# Altium project OTimCon_Station.PrjPcb
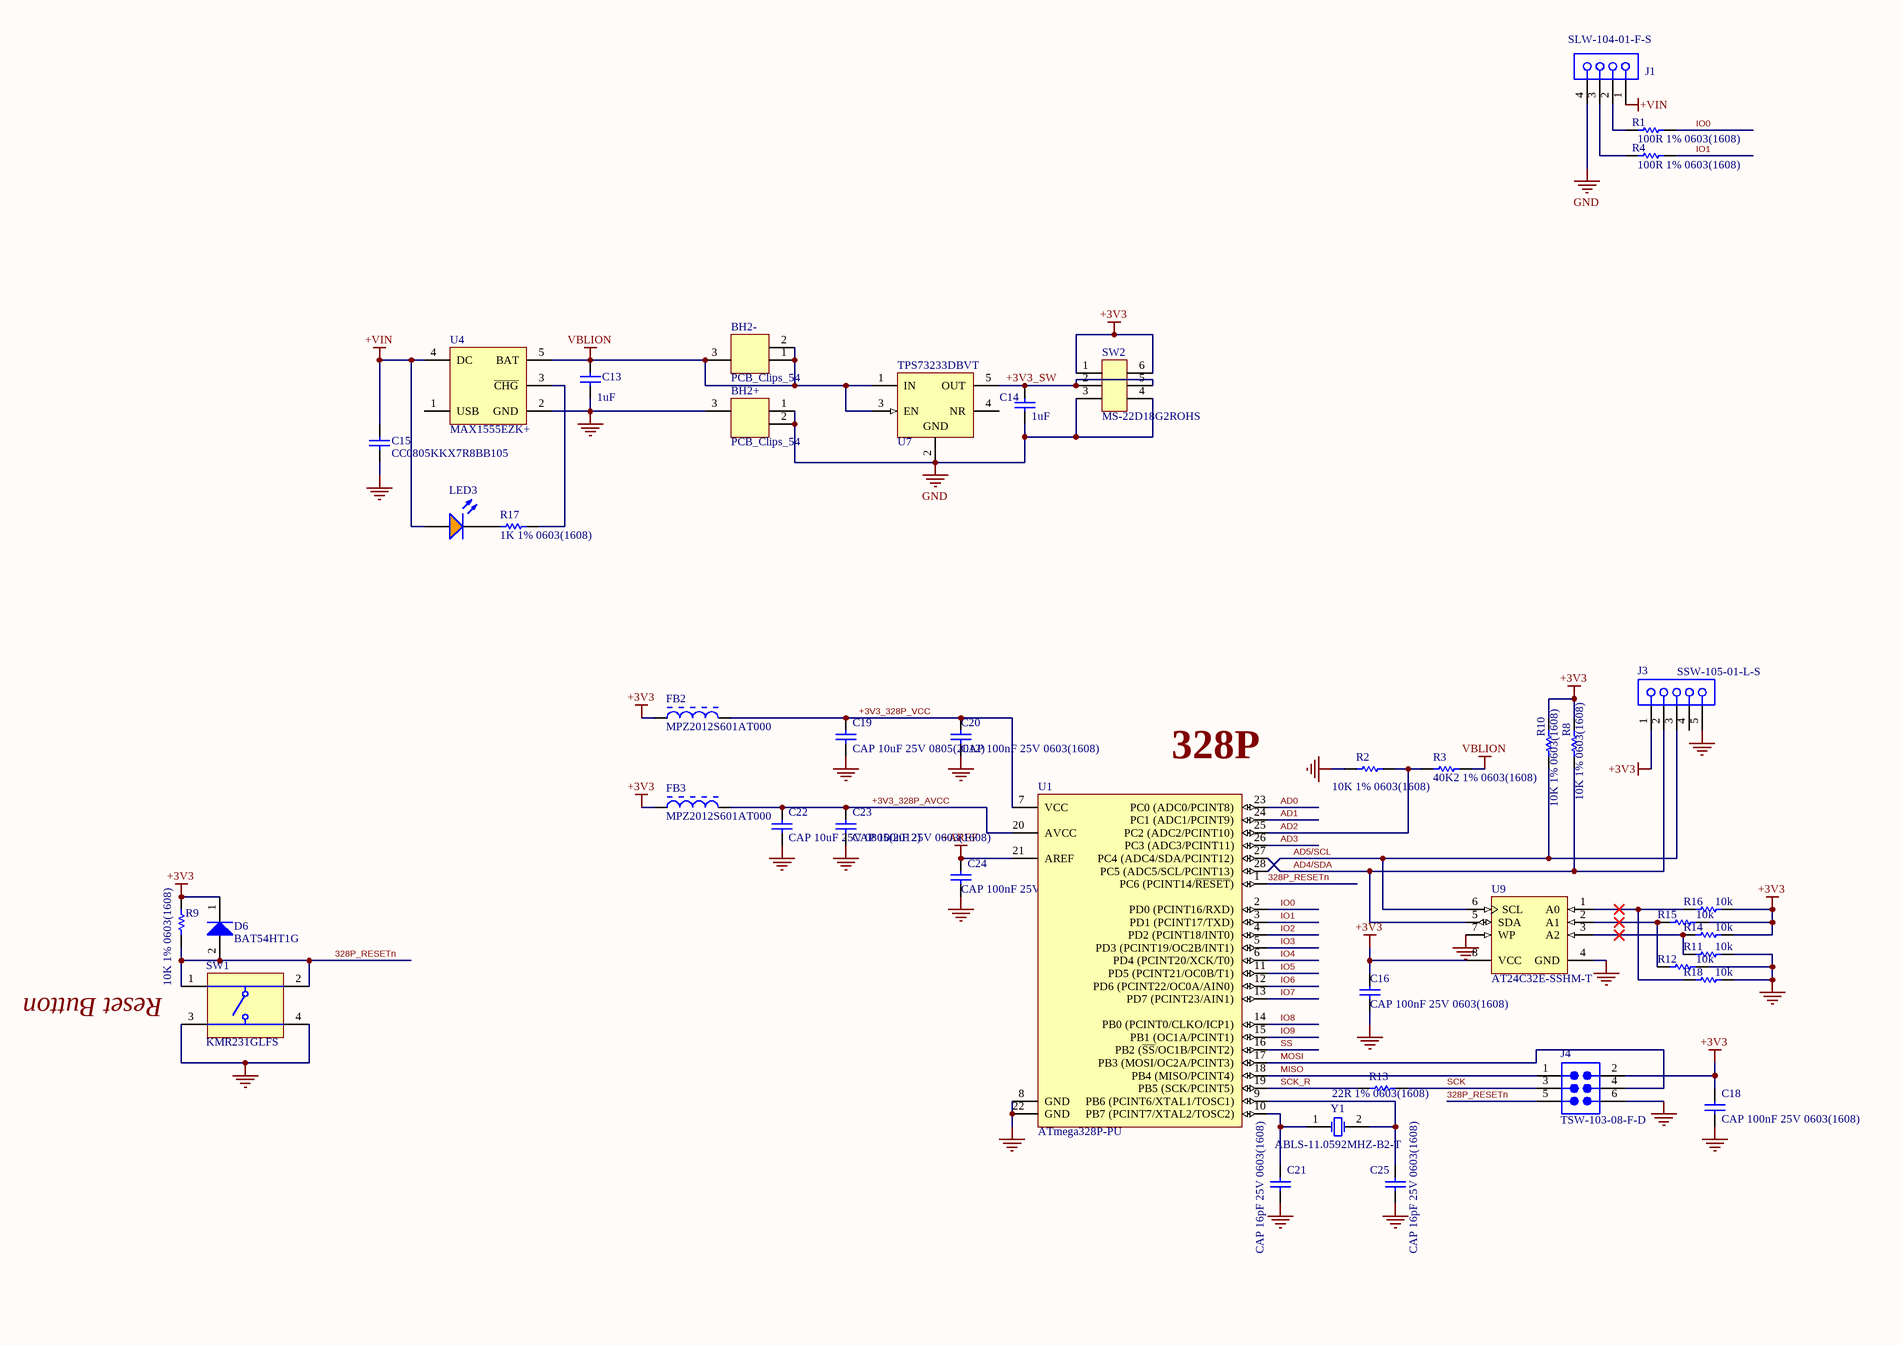
[diagram p0: OTimCon_Station.SchDoc, left]
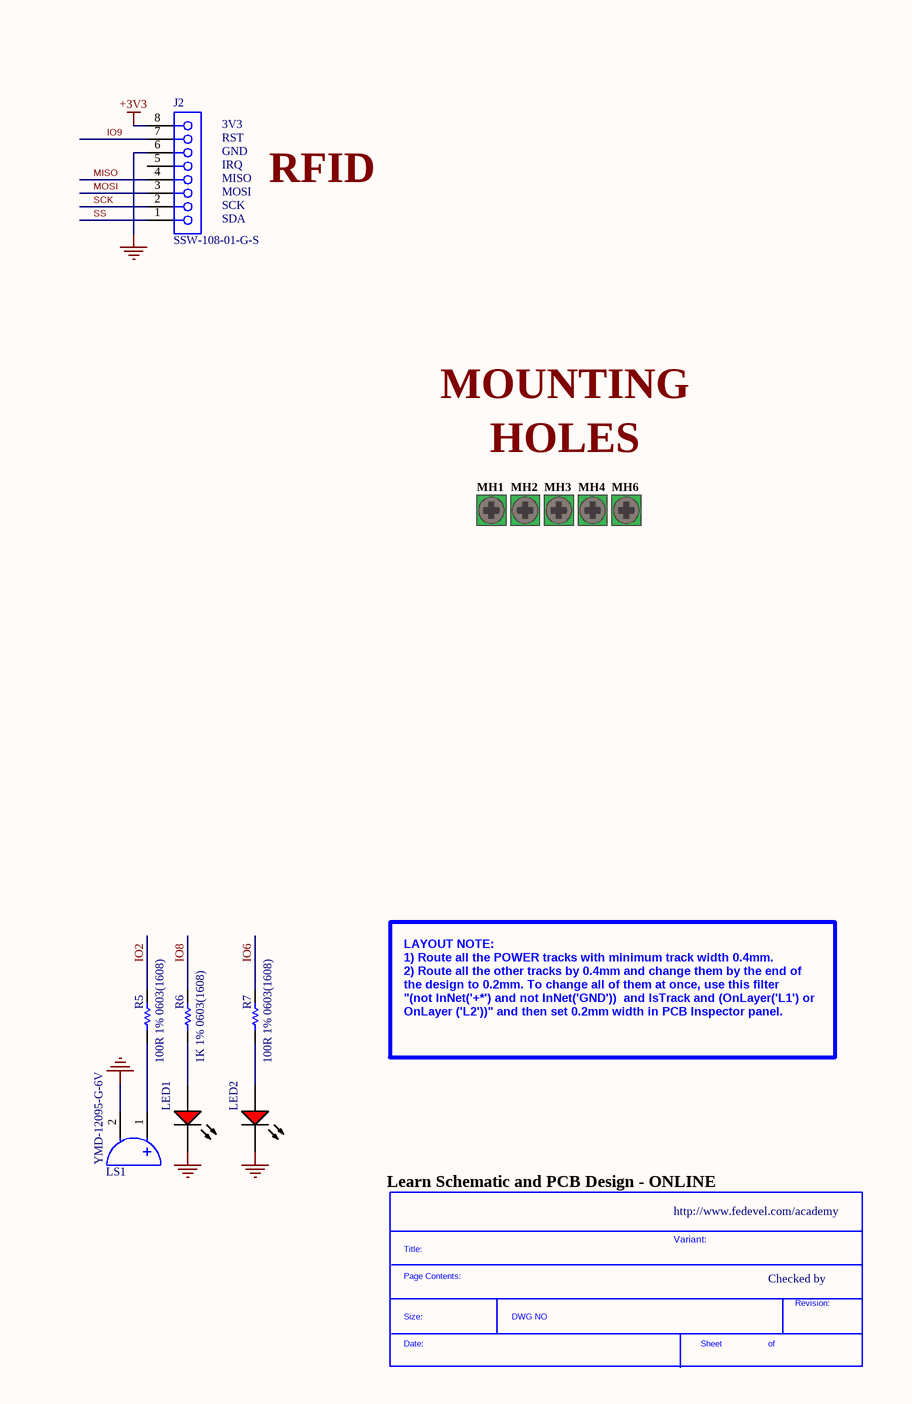
[diagram p1: OTimCon_Station.SchDoc, right]
ClientContactEmail: kus.michal@gmail.com; ClientContactName: Micha³ Kuœ; NotFitted: NF; Project: OTimCon-Board; VersionRevision: ver. 0.2
1 sheet, 56 parts. Net scope: global (net labels, ports and power ports of the same name join across sheets).
Board file: OTimCon_Station.PcbDoc

## Sheet OTimCon_Station.SchDoc
size A2; DocumentNumber: 3; SheetNumber: 3; SheetTotal: 5; PageSetup: Record=PageOptions|CenterHorizontal=True|CenterVertical=True|PrintScale=0.73|XCorrection=1.00|YCorrection=1.00|PrintKind=0|BorderSize=5000000|LeftOffset=0|BottomOffset=0|Orientation=2|PaperLength=1000|PaperWidth=1000|Scale=100|PaperSource=7|PrintQuality=-3|MediaType=1|DitherType=10|PrintScaleMode=1|PaperKind=A3|PaperIndex=8

### Parts
*  SDTitleBlock  (value not drawn)  (graphical)
BH2+  PCB_Clips_54  [KEYSTONE-CLIPS_54-3_V]
BH2-  PCB_Clips_54  [KEYSTONE-CLIPS_54-3_V]
C13  Capacitance: 1uF  [CAPC2013X145X50ML20T25]  (hidden comment: CC0805KKX7R8BB105)
C14  Capacitance: 1uF  [CAPC2013X145X50ML20T25]  (hidden comment: CC0805KKX7R8BB105)
C15  CC0805KKX7R8BB105  [CAPC2013X145X50ML20T25]
C16  CAP 100nF 25V 0603(1608)  [CAPC0603(1608)100_M]
C18  CAP 100nF 25V 0603(1608)  [CAPC0603(1608)100_M]
C19  CAP 10uF 25V 0805(2012)  [CAPC0805(2012)145_N]
C20  CAP 100nF 25V 0603(1608)  [CAPC0603(1608)100_M]
C21  CAP 16pF 25V 0603(1608)  [CAPC0603(1608)100_L]
C22  CAP 10uF 25V 0805(2012)  [CAPC0805(2012)145_N]
C23  CAP 100nF 25V 0603(1608)  [CAPC0603(1608)100_M]
C24  CAP 100nF 25V 0603(1608)  [CAPC0603(1608)100_M]
C25  CAP 16pF 25V 0603(1608)  [CAPC0603(1608)100_L]
D6  BAT54HT1G  [ONSC-SOD-323-2-477-02_V]
FB2  MPZ2012S601AT000  [TDK-MPZ2012_V]
FB3  MPZ2012S601AT000  [TDK-MPZ2012_V]
J1  SLW-104-01-F-S  [SMTC-SLW-104-01-X-S]
J2  SSW-108-01-G-S  [SMTC-SSW-108-01-G-S]
J3  SSW-105-01-L-S  [SMTC-SSW-105-01-X-S]
J4  TSW-103-08-F-D  [SMTC-TSW-103-08-X-D]
LED1  C503B-RAN-CY0B0AA2  [CREE-C503B-RAN]  (value not drawn)
LED2  C503B-RAN-CY0B0AA2  [CREE-C503B-RAN]  (value not drawn)
LED3  LTST-C190KFKT  [LTST-C190KFKT_V]  (value not drawn)
LS1  YMD-12095-G-6V  [HKDZ-YMD-12095-G-2_V]
MH1  Mounting Hole (Screw)  [Mounting-Hole-Altium]  (value not drawn)  (no BOM)
MH2  Mounting Hole (Screw)  [Mounting-Hole-Altium]  (value not drawn)  (no BOM)
MH3  Mounting Hole (Screw)  [Mounting-Hole-Altium]  (value not drawn)  (no BOM)
MH4  Mounting Hole (Screw)  [Mounting-Hole-Altium]  (value not drawn)  (no BOM)
MH6  Mounting Hole (Screw)  [Mounting-Hole-Altium]  (value not drawn)  (no BOM)
R1  100R 1% 0603(1608)  [RESC0603(1608)_M]
R2  10K 1% 0603(1608)  [RESC0603(1608)_N]
R3  40K2 1% 0603(1608)  [RESC0603(1608)_M]
R4  100R 1% 0603(1608)  [RESC0603(1608)_M]
R5  100R 1% 0603(1608)  [RESC0603(1608)_M]
R6  1K 1% 0603(1608)  [RESC0603(1608)_M]
R7  100R 1% 0603(1608)  [RESC0603(1608)_M]
R8  10K 1% 0603(1608)  [RESC0603(1608)_N]
R9  10K 1% 0603(1608)  [RESC0603(1608)_N]
R10  10K 1% 0603(1608)  [RESC0603(1608)_N]
R11  value 10k  [RESC0603(1608)_N]  (hidden comment: 10K 1% 0603(1608))
R12  value 10k  [RESC0603(1608)_N]  (hidden comment: 10K 1% 0603(1608))
R13  22R 1% 0603(1608)  [RESC0603(1608)_M]
R14  value 10k  [RESC0603(1608)_N]  (hidden comment: 10K 1% 0603(1608))
R15  value 10k  [RESC0603(1608)_N]  (hidden comment: 10K 1% 0603(1608))
R16  value 10k  [RESC0603(1608)_N]  (hidden comment: 10K 1% 0603(1608))
R17  1K 1% 0603(1608)  [RESC0603(1608)_M]
R18  value 10k  [RESC0603(1608)_N]  (hidden comment: 10K 1% 0603(1608))
SW1  KMR231GLFS  [CKCP-KMR231GLFS]
SW2  MS-22D18G2ROHS  [DYL-MS22D18G2ROHS-6_V]
U1  ATmega328P-PU  [28P3]
U4  MAX1555EZK+  [MAXM-Z5+1_M]
U7  TPS73233DBVT  [DBV0005A_N]
U9  AT24C32E-SSHM-T  [ATML-8S1_A_L]
Y1  ABLS-11.0592MHZ-B2-T  [ABRA-ABLS-11.0592MHZ-B2-T_V]

### Nets
+3V3: C16.2 C18.2 D6.1(K) FB2.1 FB3.1 J2.8 J3.1 J4.2 R8.1 R9.1 R10.1 R14.2 R15.1 R16.2 SW2.1 SW2.6 U9.8(VCC)
+AREF: C24.2 U1.21(AREF)
+VIN: C15.1 J1.1 LED3.1(A) U4.4(DC)
GND: BH2+.1 BH2+.2 BH2+.3 C13.2 C14.2 C15.2 C16.1 C18.1 C19.1 C20.1 C21.1 C22.1 C23.1 C24.1 C25.1 J1.4 J2.6 J3.5 J4.6 LED1.2(K) LED2.2(K) LS1.2(K) R2.1 R11.2 R12.1 R18.2 SW1.3 SW1.4 SW2.3 SW2.4 U1.8(GND) U1.22(GND) U4.2(GND) U7.2(GND) U9.4(GND) U9.7(WP)
VBLION: BH2-.1 BH2-.2 BH2-.3 C13.1 R3.2 U4.5(BAT) U7.1(IN) U7.3(EN)
328P_RESETn: D6.2(A) J4.5 R9.2 SW1.1 SW1.2 U1.1(PC6_(PCINT14/~{RESET}))
+3V3_328P_AVCC: C22.2 C23.2 FB3.2 U1.20(AVCC)
+3V3_328P_VCC: C19.2 C20.2 FB2.2 U1.7(VCC)
+3V3_SW: C14.1 SW2.2 SW2.5 U7.5(OUT)
AD0: U1.23(PC0_(ADC0/PCINT8))
AD1: U1.24(PC1_(ADC1/PCINT9))
AD2: R2.2 R3.1 U1.25(PC2_(ADC2/PCINT10))
AD3: U1.26(PC3_(ADC3/PCINT11))
AD4/SDA: J3.2 R8.2 U1.27(PC4_(ADC4/SDA/PCINT12)) U9.5(SDA)
AD5/SCL: J3.3 R10.2 U1.28(PC5_(ADC5/SCL/PCINT13)) U9.6(SCL)
IO0: R1.2 U1.2(PD0_(PCINT16/RXD))
IO1: R4.2 U1.3(PD1_(PCINT17/TXD))
IO2: R5.2 U1.4(PD2_(PCINT18/INT0))
IO3: U1.5(PD3_(PCINT19/OC2B/INT1))
IO4: U1.6(PD4_(PCINT20/XCK/T0))
IO5: U1.11(PD5_(PCINT21/OC0B/T1))
IO6: R7.2 U1.12(PD6_(PCINT22/OC0A/AIN0))
IO7: U1.13(PD7_(PCINT23/AIN1))
IO8: R6.1 U1.14(PB0_(PCINT0/CLKO/ICP1))
IO9: J2.7 U1.15(PB1_(OC1A/PCINT1))
MISO: J2.4 J4.1 U1.18(PB4_(MISO/PCINT4))
MOSI: J2.3 J4.4 U1.17(PB3_(MOSI/OC2A/PCINT3))
SCK: J2.2 J4.3 R13.2
SCK_R: R13.1 U1.19(PB5_(SCK/PCINT5))
SS: J2.1 U1.16(PB2_(~{SS}/OC1B/PCINT2))
NetC21_2: C21.2 U1.10(PB7_(PCINT7/XTAL2/TOSC2)) Y1.1(X1)
NetC25_2: C25.2 U1.9(PB6_(PCINT6/XTAL1/TOSC1)) Y1.2(X2)
NetJ1_2: J1.2 R1.1
NetJ1_3: J1.3 R4.1
NetLED1_1: LED1.1(A) R6.2
NetLED2_1: LED2.1(A) R7.1
NetLED3_2: LED3.2(K) R17.1
NetLS1_1: LS1.1(A) R5.1
NetR11_1: R11.1 R14.1 U9.3(A2)
NetR12_2: R12.2 R15.2 U9.2(A1)
NetR16_1: R16.1 R18.1 U9.1(A0)
NetR17_2: R17.2 U4.3(~{CHG})

Not connected (* = marked no-connect by the designer): J2 5; J3 4; MH1 1; MH2 1; MH3 1; MH4 1; MH6 1; U4 1(USB); U7 4(NR)

### Notes on the sheet
- (near J2) 3V3
- (near J2) RST
- (near J2) GND
- (near J2) IRQ
- (near J2) MISO
- (near J2) MOSI
- (near J2) SCK
- (near J2) SDA
- RFID
- (near U1) 328P
- MOUNTING
- HOLES
- (near SW1) Reset Button
- LAYOUT NOTE:
  1) Route all the POWER tracks with minimum track width 0.4mm.
  2) Route all the other tracks by 0.4mm and change them by the end of the design to 0.2mm. To change all of them at once, use this filter
  "(not InNet('+*') and not InNet('GND'))  and IsTrack and (OnLayer('L1') or OnLayer ('L2'))" and then set 0.2mm width in PCB Inspector panel.
- (near *) Learn Schematic and PCB Design - ONLINE
- http://www.fedevel.com/academy
- Variant:
- Checked by
- (in symbol SDTitleBlock) Title:; Page Contents:; Revision:; Size:; DWG NO; Date:; Sheet; of

### Library data of the parts
BH2+ BH2- = CMP-0466-00001-2: PC Battery Clip, Catalog No.54, Spring Steel, Body 18.102 x 13.004 mm, THM; Manufacturer: Keystone; Finish/Plating: Tin-Nickel; Cell Size: 18650; # of Cells: 1; Material: Spring Steel; ComponentLink1URL: http://www.keyelco.com/; PackageReference: KEYSTONE-CLIPS_54-3; PartNumber: PCB_Clips_54; Type: CLIP; Mounting Technology: Through Hole; PackageDescription: 3-Pin Hand Drawn, Body 18.102 x 13.004 mm; ComponentLink2URL: http://www.keyelco.com/userAssets/file/M60-2p9.pdf; ComponentLink2Description: Datasheet; ComponentLink1Description: Manufacturer URL
C13 C14 = CMP-2100-03605-1: Chip Capacitor, 1 uF, 25 V, 10%, -55 to 125 degC, 0805 (2012 Metric), RoHS, Tape and Reel; Manufacturer: Yageo; Voltage Rating: 25V; Dissipation Factor: 5%; Dielectric: X7R; Length: 2mm; REACH SVHC: NoSVHC; Package Reference: 0805; Lead Free: LeadFree; Datasheet Version: Rev. 15, 10/2016; Width: 0.049inch; Thickness: 0.057inch; Case Code (Metric): 2012; Tolerance: 10%; Datasheet URL: http://www.yageo.com/documents/recent/UPY-GPHC_X7R_6.3V-to-50V_15.pdf; Number of Pins: 2; Radiation Hardening: No; Max Operating Temperature: 125degC; Depth: 1.25mm; Composition: Ceramic; Case Code (Imperial): 0805; Manufacturer URL: http://www.yageo.com/; Case/Package: 0805; Min Operating Temperature: -55degC; Mount: SurfaceMount; Package Description: 2-Pin Surface Mount Device, Body 2 x 1.25 mm; Height: 1.25mm; Termination: SMD/SMT; Packaging: TapeandReel; RoHSCompliant: True; Package Quantity: 3000; Voltage Rating (DC): 25V
C15 = CMP-2100-03605-1: Chip Capacitor, 1 uF, 25 V, 10%, -55 to 125 degC, 0805 (2012 Metric), RoHS, Tape and Reel; Manufacturer: Yageo; Capacitance: 1uF; Voltage Rating: 25V; Dissipation Factor: 5%; Dielectric: X7R; Length: 2mm; REACH SVHC: NoSVHC; Package Reference: 0805; Lead Free: LeadFree; Datasheet Version: Rev. 15, 10/2016; Width: 0.049inch; Thickness: 0.057inch; Case Code (Metric): 2012; Tolerance: 10%; Datasheet URL: http://www.yageo.com/documents/recent/UPY-GPHC_X7R_6.3V-to-50V_15.pdf; Number of Pins: 2; Radiation Hardening: No; Max Operating Temperature: 125degC; Depth: 1.25mm; Composition: Ceramic; Case Code (Imperial): 0805; Manufacturer URL: http://www.yageo.com/; Case/Package: 0805; Min Operating Temperature: -55degC; Mount: SurfaceMount; Package Description: 2-Pin Surface Mount Device, Body 2 x 1.25 mm; Height: 1.25mm; Termination: SMD/SMT; Packaging: TapeandReel; RoHSCompliant: True; Package Quantity: 3000; Voltage Rating (DC): 25V
C16 C18 C20 C23 C24 = CMP-1035-02588-1: CAP 100nF 25V ±10% 0603 (1608 Metric) Thickness 1mm SMD; Case-Metric: 1608; Case-EIA: 0603; Tolerance: Â±10%; Max Thickness: 1 mm; Technology: SMT; Rated Voltage: 25 V; Value: 100nF
C19 C22 = CMP-1036-04932-1: CAP 10uF 25V ±10% 0805 (2012 Metric) Thickness 1.45mm SMD; Case-EIA: 0805; Case-Metric: 2012; Tolerance: Â±10%; Technology: SMT; Value: 10uF; Rated Voltage: 25 V; Max Thickness: 1.45 mm
C21 C25 = CMP-1035-00712-1: CAP 16pF 25V ±10% 0603 (1608 Metric) Thickness 1mm SMD; Tolerance: Â±10%; Case-Metric: 1608; Case-EIA: 0603; Technology: SMT; Rated Voltage: 25 V; Value: 16pF; Max Thickness: 1 mm
D6 = CMP-1055-00462-1: Schottky Barrier Diode, 2-Pin SOD-323, Pb-Free, Tape and Reel; Manufacturer: On Semiconductor; Configuration: Single; trr Max (ns): 5; IFSM Max (A): 0.6; ComponentLink3URL: http://www.onsemi.com/pub_link/Collateral/477-02.PDF.1; PackageDescription: 2-Pin SOD, Body 1.7 x 1.25 mm; ComponentLink2URL: http://www.onsemi.cn/pub_link/Collateral/BAT54HT1-D.PDF; ComponentLink3Description: Package Specification; ComponentLink2Description: Datasheet; DatasheetVersion: Rev. 6; PackageReference: SOD-323-2-477-02; RoHS: TRUE; ComponentLink1URL: http://www.onsemi.com/; Packing: Tape and Reel; PartNumber: BAT54HT1G; Mounting Technology: Surface Mount; ComponentLink1Description: Manufacturer URL; PackageVersion: Rev. H, 03/2007
FB2 FB3 = CMP-2000-05401-1: Chip Bead, 0.1 Ohm, 2 A, -55 to 125 degC, 2-Pin SMD (0805), RoHS, Tape and Reel; PCN Part Number: MMZ,MPSSeriesOct/2014; Manufacturer: TDK; Impedance @ Frequency: 600Ohm@100MHz; Other Names: 445-2206-6; Catalog Drawings: (MMZ,MPZ)2012SeriesTop / (MMZ,MPZ)2012SeriesFootprint / (MMZ,MPZ)2012SeriesSide; DC Resistance (DCR): 100mOhmMax; Current Rating: 2A; Product Training Modules: EMCComponents; Filter Type: DifferentialMode-Single; Online Catalog: MPZ2012Series; Datasheet URL: http://datasheet.octopart.com/MPZ2012S601AT000-TDK-datasheet-12512619.pdf; Package Reference: 805; Package / Case: 0805(2012Metric); Packaging: Digi-Reel; Mounting Type: SurfaceMount; Family: FerriteBeadsandChips; Category: Filters; Datasheet Version: Sep-12; Manufacturer URL: http://www.tdk.com/; Series: MPZ; Package Description: 2-Pin Surface Mount Device, Body 2 x 1.25 mm; Standard Package: 1; Size / Dimension: 0.079"Lx0.049"W(2.00mmx1.25mm); Height (Max): 0.041"(1.05mm)
J1 = CMP-1023-00132-1: Low Profile Socket Strips, Through-hole, Vertical, -55 to 125 degC, 2.54 mm Pitch, 4-Pin, Female, RoHS; Manufacturer: Samtec; Pitch: 2.54 mm; PackageVersion: X, 9/1987; ComponentLink2Description: Datasheet; PackageDescription: Low Profile Socket Strip; ComponentLink1URL: http://www.samtec.com; Orientation: Vertical; ComponentLink3URL: http://www.samtec.com/documents/webfiles/cpdf/SLW-1XX-01-X-X-MKT.pdf; ComponentLink1Description: Manufacturer URL; ComponentLink2URL: http://www.samtec.com/documents/webfiles/pdf/SLW.PDF; PackageReference: SLW-104-01-X-S; Mounting Technology: Through-hole; PartNumber: SLW-104-01-F-S; Temperature Range: -55 to 125 degC; DatasheetVersion: F-214; ComponentLink3Description: Package Specification; RoHS: True
J2 = CMP-1272-00001-1: SOCKET, Through-hole, Vertical, -55 to 125 degC, 2.54 mm Pitch, 8-Pin Female, RoHS; Manufacturer: Samtec; Number of Positions: 8; Packing: Bulk; Pitch: 2.54 mm; PartNumber: SSW-108-01-G-S; PackageDescription: 1x8 Pins SQ Post Socket, Vertical, Body 20.5 x 2.41 mm, Pitch 2.54 mm, Female; Termination: Through-hole; ComponentLink2URL: http://www.samtec.com/documents/webfiles/cpdf/SSW-1XX-XX-XXX-X-XX-XXX-XX-MKT.pdf; PackageVersion: Rev. A; ComponentLink3URL: http://www.samtec.com/documents/webfiles/cpdf/SSW-S.PDF; ComponentLink2Description: Datasheet; Mounting Technology: Through Hole; Orientation: Vertical; DatasheetVersion: Rev. CA; ComponentLink1Description: Manufacturer URL; Operating Temperature Range: -55 to 125 degC; RoHS: TRUE; Contact Finish: Gold; Contact Type: Female Socket; Number of Rows: 1; ComponentLink1URL: http://www.samtec.com/; ComponentLink3Description: Package Specification
J3 = CMP-1023-00347-1: SQ Post Socket, Through-hole, Vertical, -55 to 125 degC, 2.54mm Pitch, 5-Pin, Female, RoHS; Manufacturer: Samtec; Pitch: 2.54 mm; ComponentLink1URL: http://www.samtec.com; Mounting Technology: Through-hole; ComponentLink2Description: Datasheet; ComponentLink1Description: Manufacturer URL; Orientation: Vertical; ComponentLink2URL: http://www.samtec.com/documents/webfiles/pdf/SSW_TH.PDF; ComponentLink3URL: http://www.samtec.com/documents/webfiles/cpdf/SSW-1XX-XX-XXX-X-XX-XXX-XX-MKT.pdf; PartNumber: SSW-105-01-L-S; Temperature Range: -55 to 125 degC; PackageReference: SSW-105-01-X-S; DatasheetVersion: F-214; PackageDescription: Assembly, Socket Strip .016 X .031 Tail; ComponentLink3Description: Package Specification; PackageVersion: CA, 6/1987; RoHS: True
J4 = CMP-1024-00337-1: 0.025" SQ Post Header, Through-hole, Vertical, -55 to 125 degC, 2.54 mm Pitch, 6-Pin, Male, RoHS; Manufacturer: Samtec; Pitch: 2.54 mm; ComponentLink1URL: http://www.samtec.com; PackageReference: TSW-103-08-X-D; ComponentLink3Description: Package Specification; PackageDescription: .025[0.64] SQ. Post Terminal Strip Assembly; PartNumber: TSW-103-08-F-D; DatasheetVersion: F-214; ComponentLink1Description: Manufacturer URL; ComponentLink2Description: Datasheet; ComponentLink2URL: http://www.samtec.com/documents/webfiles/pdf/TSW_TH.PDF; PackageVersion: DM, 8/1988; Orientation: Vertical; Mounting Technology: Through-hole; RoHS: True; Temperature Range: -55 to 125 degC; ComponentLink3URL: http://www.samtec.com/documents/webfiles/cpdf/TSW-XXX-XX-XXX-X-XX-XXX-MKT.pdf
LED1 LED2 = CMP-2000-06058-1: Cree(R) 5-mm Red Round LED, 2.1 V, -40 to 100 degC, 2-Pin THD, RoHS, Ammo; Forward Current: 50mA; Product Depth (mm): 5.8mm; Power Dissipation: 130mW; Viewing Angle: 15°; Test Current (It): 20mA; Type: Uni-Color; Shape Type: Circular; Product Height (mm): 8.8mm; Luminous Intensity: 12000mcd; Main Category: StandardLED; Forward Voltage: 2.6V; Number of  Elements: 1; Dominant Wave Length: 624nm; Reverse Voltage: 5V; Mounting Technology: ThroughHole; Datasheet Version: 12/2014; Manufacturer URL: http://www.cree.com/; Packaging: AmmoPack; Operating Temperature Classification: Industrial; Package Description: 2-Pin Through Hole Device, Dia 5.8 mm, Pitch 2.54 mm; Package Reference: C503B-RAN; Product Length (mm): 5.8mm; Datasheet URL: http://www.cree.com/sitecore-modules/web/~/media/Files/Cree/LED-Components-and-Modules/HB/Data-Sheets/C503B-RAS-RAN-AAS-AAN-RBS-RBN-ABS-ABN-RCS-RCN-ACS-ACN-1079.pdf; Operating Temp Range: -40Cto100C; Manufacturer: Cree; Mounting: ThroughHole; Emitting Color: Red; Lens Dimensions: 5x5x7.8mm; Package Type: T-13/4; Pin Count: 2
LED3 = CMP-1674-00008-1: LED Uni-Color Orange, 75 mW, 30 mA, -35 to 85 degC, 2-Pin SMD, RoHS, Tape and Reel; Resistance: 47 kohm; Power Rating: 100 mW; Case\Package: 0603; Tolerance: 1%; Voltage Rating (DC): 50 V; ComponentLink2URL: http://optoelectronics.liteon.com/upload/download/DS-22-99-0186/S_110_LTST-C190KFKT.pdf; Mount: Surface Mount; Pins: 2; Package Quantity: 5000; Max Operating Temperature: 155 degC; RoHSCompliant: true; PackageDescription: 2-Pin Surface Mount Device, Body 1.6 x 0.8 mm; Case Code (Metric): 1608; PackageReference: C190KFKT; Height: 0.45 mm; ComponentLink2Description: Datasheet; Min Operating Temperature: -55 degC; DatasheetVersion: Rev. I, 09/2011; Packaging: Tape and Reel; ComponentLink1Description: Manufacturer URL; ComponentLink1URL: http://www.us.liteon.com/; Voltage Rating: 50 V; Case Code (Imperial): 0603; Length: 1.6 mm; Width: 0.8 mm; REACH SVHC: No SVHC
LS1 = CMP-0912-00001-1: Electromagnetic Active Buzzer, 6 V, 32 mA, -20 to 45 degC, 2-Pin THD, RoHS; Manufacturer: Huakai Electronic; Soud Output: >=85 dB; Rated Current: <=32 mA; Resonant Freq: 2300 +/- 300 Hz; Operating Voltage: 4 to 8 V; Rated Voltage: 6 V; PackageDescription: 2-Pin THD, Dia 12 mm, Height 10 mm; Mounting Technology: Through Hole; ComponentLink3URL: å°è£…æ•°æ®ï¼š http://www.hongyan-e.com/web/fmq011.htm; PackageReference: YMD-12095-G-2; RoHS: TRUE; ComponentLink1Description: Manufacturer URL; Operating Temperature: -20 to 45 degC; ComponentLink2Description: Datasheet; ComponentLink1URL: http://www.xhhkdz.com/; PartNumber: YMD-12095-G-6V; ComponentLink3Description: URL Link1; ComponentLink2URL: http://www.xhhkdz.com/product/?103_688.html
MH1-MH4 MH6 = Mounting-Hole-Screw: Mounting Hole, M3 Screw
R1 R4 R5 R7 = CMP-1012-00397-1: 100R 0.1W 1% 0603 (1608 Metric)  SMD; Value: 100.00 Ohm; Case-EIA: 0603; Case-Metric: 1608; Technology: SMT; Tolerance: 1 %; Power: 0.1 W
R2 R8-R10 = CMP-1012-00623-1: 10K 0.1W 1% 0603 (1608 Metric)  SMD; Value: 10000.00 Ohm; Case-EIA: 0603; Case-Metric: 1608; Power: 0.1 W; Tolerance: 1 %; Technology: SMT
R3 = CMP-1012-00691-1: 40K2 0.1W 1% 0603 (1608 Metric)  SMD; Case-Metric: 1608; Value: 40200.00 Ohm; Case-EIA: 0603; Tolerance: 1 %; Technology: SMT; Power: 0.1 W
R6 R17 = CMP-1012-00510-1: 1K 0.1W 1% 0603 (1608 Metric)  SMD; Case-Metric: 1608; Case-EIA: 0603; Value: 1000.00 Ohm; Technology: SMT; Tolerance: 1 %; Power: 0.1 W
R11 R12 R14-R16 R18 = CMP-1012-00623-1: 10K 0.1W 1% 0603 (1608 Metric)  SMD; Case-EIA: 0603; Case-Metric: 1608; Power: 0.1 W; Tolerance: 1 %; Technology: SMT
R13 = CMP-1012-00320-1: 22R 0.1W 1% 0603 (1608 Metric)  SMD; Value: 22.00 Ohm; Case-EIA: 0603; Case-Metric: 1608; Power: 0.1 W; Technology: SMT; Tolerance: 1 %
SW1 = CMP-2000-06516-1: Switch Tactile, SPST, 50 mA, 32 V, -40 to 85 degC, 4-Pin SMD, RoHS, Tape and Reel; Manufacturer: C&K Components; Mechanical Life: 150000Cycles; Switch Configuration: N.O.; Actuator Style: Button; Ground Terminal: Yes; Maximum DC Voltage Rating: 32V; Minimum Insulation Resistance: >=1000MOhm; Dielectric Strength: >=250Vrms; Operating Force: 3N; Illumination Type: N/R; Body Orientation: Straight; Contact Rating @ Voltage: 1A; Actuator Length: 0.5mm; Operating Temperature: -40to85C; Electrical Life: N/A; Housing Material: N/A; ECCN: EAR99; Pole Throw Configuration: SPST; Contact Plating: Silver; Dimension: 2.8x4.6x1.9mm; Type: Micro-Miniature; Product Weight: N/A; Package Description: 4-Pin Surface Mount Device, Body 4.6 x 2.8 mm; Actuator Color: N/A; HTS: 8536501199; Mounting Technology: SurfaceMount; Mounting: SurfaceMount,GullWing; Seal Location: N/A; Base Material: N/A; Family: KMR2; Part No: KMR231GLFS; Datasheet Version: 06/2016; Contact Material: Silver; Package Reference: KMR231GLFS; Manufacturer URL: http://www.ckswitches.com/; Maximum AC Voltage Rating: N/A; Datasheet URL: http://www.ck-components.com/media/1479/kmr2.pdf; RoHS: Yes; Seal Description: N/A; Packaging: TapeandReel; Supplier: C&KComponents
SW2 = CMP-2100-03658-1: Slide Switch, 30 V, 0.3 A, -20 to 80 degC, 6-Pin THD, RoHS; Manufacturer: Deyilong; Package Description: 6-Pin Through Hole Device, Body 3.5 x 9.1 mm, Pitch 2.5 mm; Manufacturer URL: https://dgsdyn.cn.china.cn/; Datasheet Version: 41091.0; Package Reference: MS22D18G2ROHS; Datasheet URL: http://datasheet.octopart.com/MS-22D18-G2-ROHS-Deyilong-datasheet-62330931.pdf
U1 = CMP-0095-00013-2: 8-bit AVR Microcontroller, 32KB Flash, 1KB EEPROM, 2KB SRAM, 28-pin PDIP, Industrial Grade (-40°C to 85°C); RevisionNote: DatasheetVersion updated. URLs added.; PackageVersion: revB, Sep-2001; DatasheetVersion: revD, May-2011; ComponentLink1Description: Manufacturer URL; ComponentLink1URL: http://www.atmel.com/; PackageReference: 28P3; ComponentLink2Description: ATmega48A/48PA/88A/88PA/168A/168PA/328/328P Datasheet; ComponentLink3URL: http://www.atmel.com/dyn/resources/prod_documents/8271S.pdf; ComponentLink2URL: http://www.atmel.com/dyn/resources/prod_documents/8271.pdf; ComponentLink3Description: ATmega48A/48PA/88A/88PA/168A/168PA/328/328P Summary; PackageDescription: 28-lead (0.300"/7.62mm Wide) Plastic Dual Inline Package (PDIP)
U4 = CMP-0246-00651-1: Dual-Input USB/AC Adapter 1-Cell Li+ Battery Charger, 4.2 V Charger Voltage, 0.28 A DC Charging Current, 5-Pin TSOT Package, RoHS; Manufacturer: Maxim; Max Charging VIN (V): 7; Lithium Ion Cells: 1; Charger (V): 4.2; ICHG Typ: 0.28 A; Package: TSOT; Operating Temperature Range: -40 to 85 degC; ComponentLink3Description: Package Specification; PackageVersion: Rev. D; RoHS: TRUE; ComponentLink2URL: http://datasheets.maximintegrated.com/en/ds/MAX1551-MAX1555.pdf; PackageReference: Z5+1; ComponentLink1Description: Manufacturer URL; PartNumber: MAX1555EZK+; PackageDescription: 5-Pin Thin SOT23, Body 2.9 x 1.6 mm, Pitch 0.95 mm; ComponentLink2Description: Datasheet; ComponentLink1URL: http://www.maximintegrated.com/; ComponentLink3URL: http://pdfserv.maximintegrated.com/package_dwgs/21-0113.PDF; DatasheetVersion: Rev. 0; Mounting Technology: Surface Mount; Max Protected VIN (V): 7
U7 = CMP-0394-00348-2: Single Output Fast Transient Response LDO, 200 mA, Fixed 3.3 V Output, 1.7 to 5.5 V Input, with Reverse Current Protection, 5-pin SOT-23 (DBV), -40 to 85 degC, Green (RoHS & no Sb/Br); Manufacturer: Texas Instruments; Iout(Max)(A): 0.25; Iq(Typ)(mA): 0.4; Vin(Max)(V): 5.5; Vout Adj(Max)(V): 3.3; Vin(Min)(V): 1.7; Vdo(Typ)(mV): 40; Accuracy(%): 1; SubFamily: Single Channel LDO; PackageDescription: 5-Pin Plastic Small Outline, Body 1.60 Ãƒâ€” 2.90 mm, Pitch 0.95 mm; DatasheetVersion: SBVS037O; ComponentLink3URL: http://www.ti.com/litv/pdf/mpds018i; PackageReference: DBV0005A; ComponentLink2Description: Datasheet; Eco-Plan: Green (RoHS & no Sb/Br); Code_JEDEC: MO-178; Vout Adj(Min)(V): 3.3; ComponentLink3Description: Package Specification; ComponentLink2URL: http://www.ti.com/general/docs/lit/getliterature.tsp?genericPartNumber=TPS73233&fileType=pdf; PackageVersion: 4073253-4/K; Mounting Technology: Surface Mount; ComponentLink1Description: Manufacturer URL; Fixed Output Options(V): 3.3; PartNumber: TPS73233DBVT; ComponentLink1URL: http://www.ti.com/
U9 = CMP-0152-00063-1: 2-Wire I2C-Compatible Serial EEPROM, 1.7 to 3.6 V, -40 to 85 degC, 8-Pin SOIC (S1), RoHS, Tape and Reel; Voltage Supply Max: 3.6 V; Memory Size: 0.032 Mbits; Supply Current Max: 1 mA; Voltage Supply Min: 1.7 V; ComponentLink2Description: Datasheet; Temperature Min: -40 degC; PackageDescription: 8-Pin Small Outline Package, Body 4.9 x 3.9 mm, Pitch 1.27 mm; ComponentLink1Description: Manufacturer URL; ComponentLink2URL: http://www.atmel.com/Images/Atmel-8905-SEEPROM-AT24C32E-Datasheet.pdf; Temperature Max: 85 degC; Code_JEDEC: MS-012; ComponentLink1URL: http://www.atmel.com/; RoHS: TRUE; PartNumber: AT24C32E-SSHM-T; Mounting Technology: Surface Mount; Generic Part Number: AT24C32E; PackageVersion: Rev. H, 03/2015; Packing: Tape and Reel; DatasheetVersion: Rev. 8905E; Part Number: AT24C32E
Y1 = CMP-2000-05724-1: HC / 49 US (AT49) Low Profile Crystal, 11.0592 MHz, 0 to 70 degC, 2-Pin SMD, RoHS, Tape and Reel; ESR: 50Ohms; Case Height: 4.2mm; Load Capacitance: 18pF; Case Length: 11.4mm; Frequency Stability: 50PPM; Tolerance: 20PPM; Brand: ABRACON; Case Width: 4.7mm; Factory Pack Quantity: 1000; RoHS: Details; Type: LowProfileMicroprocessorCrystal; Mounting Technology: SurfaceMount; Series: ABLS; Dimensions: 4.7mmWx11.4mmLx4.2mmH; Package Description: 2-Pin Surface Mount Device, Body 11.4 x 4.7 mm; Manufacturer URL: http://www.abracon.com/; Datasheet URL: http://www.mouser.com/ds/2/3/abls-44621.pdf; Package / Case: HC-49/US; Datasheet Version: 04/2011; Packaging: Reel; Frequency: 11.0592MHz; Mounting Style: SMD/SMT; Manufacturer: ABRACON; Product Category: Crystals; Operating Temperature Range: -20Cto+70C; Package Reference: ABLS-11.0592MHZ-B2-T; Termination Style: SMD/SMT